# Altium schematic sheet X-Bus.schdoc
size 277 x 134 mm; SheetNumber: 1; SheetTotal: 1
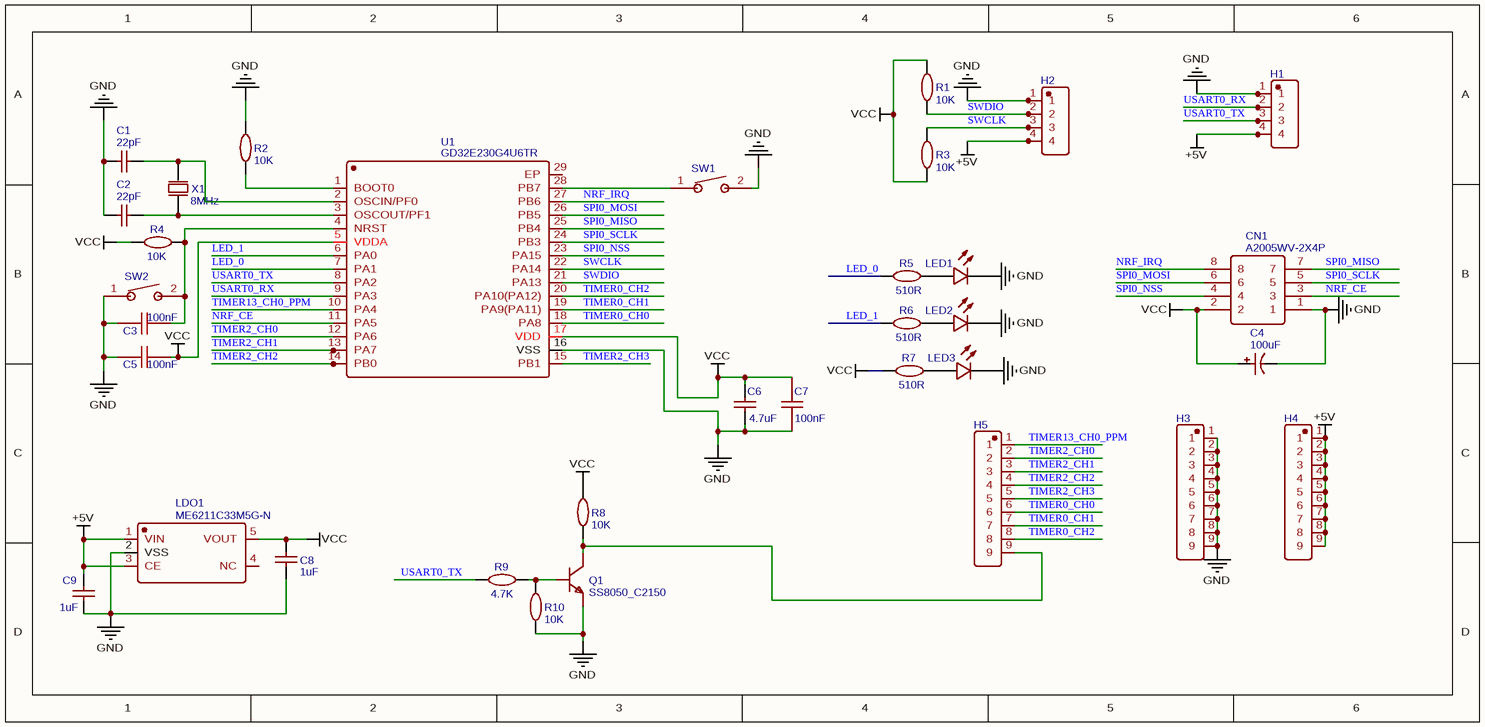
[diagram p0: X-Bus.schdoc]

## Parts
C1  22pF  [C0603_L]
C2  22pF  [C0603_L]
C3  100nF  [C0603_L]
C4  100uF  [CAP 2.5*6.3*11.2-H - BK]
C5  100nF  [C0603_L]
C6  4.7uF  [C0603_L]
C7  100nF  [C0603_L]
C8  1uF  [C0603_L]
C9  1uF  [C0603_L]
CN1  A2005WV-2X4P  [NRF24L01_E01]
H1  GP26-2520WV-4P  [HDR2.54-LI-4P]  (value not drawn)
H2  GP26-2520WV-4P  [HDR2.54-LI-4P]  (value not drawn)
H3  PZ254V-11-09P  [HDR2.54-LI-9P]  (value not drawn)
H4  PZ254V-11-09P  [HDR2.54-LI-9P]  (value not drawn)
H5  PZ254V-11-09P  [HDR2.54-LI-9P]  (value not drawn)
LDO1  ME6211C33M5G-N  [ME6211]
LED1  19-217/GHC-YR1S2/3T  [LED 3MM-B]  (value not drawn)
LED2  19-217/GHC-YR1S2/3T  [LED 3MM-G]  (value not drawn)
LED3  19-217/GHC-YR1S2/3T  [LED 3MM-R]  (value not drawn)
Q1  SS8050_C2150  [SS8050]
R1  10K  [R0603_L]
R2  10K  [R0603_L]
R3  10K  [R0603_L]
R4  10K  [R0603_L]
R5  510R  [R0603_L]
R6  510R  [R0603_L]
R7  510R  [R0603_L]
R8  10K  [R0603_L]
R9  4.7K  [R0603_L]
R10  10K  [R0603_L]
SW1  TSA363G25-250B  [YD-3410]  (value not drawn)
SW2  TSA363G25-250B  [YD-3410]  (value not drawn)
U1  GD32E230G4U6TR  [QFN-28_L4.0-W4.0-P0.40-BL-EP]
X1  8MHz  [OSC 5032-8M]

## Nets
+5V: C9.2 H1.4 H2.4 H4.1 H4.2 H4.3 H4.4 H4.5 H4.6 H4.7 H4.8 H4.9 LDO1.1(VIN) LDO1.3(CE)
GND: C1.1 C2.1 C3.2 C4.2 C5.1 C6.2 C7.2 C8.1 C9.1 CN1.1 H1.1 H2.1 H3.1 H3.2 H3.3 H3.4 H3.5 H3.6 H3.7 H3.8 H3.9 LDO1.2(VSS) LED1.2(C) LED2.2(C) LED3.2(C) Q1.2(E) R2.2 R10.1 SW1.2 SW2.1 U1.16(VSS)
VCC: C4.1 C5.2 C6.1 C7.1 C8.2 CN1.2 LDO1.5(VOUT) R1.2 R3.1 R4.2 R7.2 R8.2 U1.5(VDDA) U1.17(VDD)
LED_0: R5.2 U1.7(PA1)
LED_1: R6.2 U1.6(PA0)
NRF_CE: CN1.3 U1.11(PA5)
NRF_IRQ: CN1.8 U1.27(PB6)
SPI0_MISO: CN1.7 U1.25(PB4)
SPI0_MOSI: CN1.6 U1.26(PB5)
SPI0_NSS: CN1.4 U1.23(PA15)
SPI0_SCLK: CN1.5 U1.24(PB3)
SWCLK: H2.3 R3.2 U1.22(PA14)
SWDIO: H2.2 R1.1 U1.21(PA13)
TIMER0_CH0: H5.6 U1.18(PA8)
TIMER0_CH1: H5.7 U1.19(PA9(PA11))
TIMER0_CH2: H5.8 U1.20(PA10(PA12))
TIMER2_CH0: H5.2 U1.12(PA6)
TIMER2_CH1: H5.3 U1.13(PA7)
TIMER2_CH2: H5.4 U1.14(PB0)
TIMER2_CH3: H5.5 U1.15(PB1)
TIMER13_CH0_PPM: H5.1 U1.10(PA4)
USART0_RX: H1.2 U1.9(PA3)
USART0_TX: H1.3 R9.2 U1.8(PA2)
NetC1_2: C1.2 U1.2(OSCIN/PF0) X1.2(OSC2)
NetC2_2: C2.2 U1.3(OSCOUT/PF1) X1.1(OSC1)
NetC3_1: C3.1 R4.1 SW2.2 U1.4(NRST)
NetH5_9: H5.9 Q1.3(C) R8.1
NetLED1_1: LED1.1(A) R5.1
NetLED2_1: LED2.1(A) R6.1
NetLED3_1: LED3.1(A) R7.1
NetQ1_1: Q1.1(B) R9.1 R10.2
NetR2_1: R2.1 U1.1(BOOT0)
NetSW1_1: SW1.1 U1.28(PB7)

Not connected (* = marked no-connect by the designer): LDO1 4(NC); U1 29(EP)

## Library data of the parts
C1 C2 = 22pF: BOM_Manufacturer: YAGEO; BOM_Manufacturer Part: CC0603JRNPO9BN220; nameAlias: Capacitance; BOM_Supplier: LCSC; BOM_Supplier Part: C105620; BOM_JLCPCB Part Class: Extended Part; spicePre: C; spiceSymbolName: CC0603JRNPO9BN220
C3 C5 C7 = 100nF: BOM_Manufacturer: YAGEO; BOM_Manufacturer Part: CC0603KRX7R9BB104; nameAlias: Capacitance; BOM_Supplier: LCSC; BOM_Supplier Part: C14663; BOM_JLCPCB Part Class: Basic Part; spicePre: C; spiceSymbolName: CC0603KRX7R9BB104
C4 = 100uF: BOM_Manufacturer: Rubycon; BOM_Manufacturer Part: 35YXJ100M6.3X11; nameAlias: Capacitance; BOM_Supplier: LCSC; BOM_Supplier Part: C88754; BOM_JLCPCB Part Class: Extended Part; spicePre: C; spiceSymbolName: 35YXJ100M6.3X11
C6 = 4.7uF: BOM_Manufacturer Part: CL10A475KO8NNNC; BOM_Manufacturer: SAMSUNG; nameAlias: Capacitance; BOM_Supplier: LCSC; BOM_Supplier Part: C19666; BOM_JLCPCB Part Class: Basic Part; spicePre: C; spiceSymbolName: CL10A475KO8NNNC
C8 C9 = 1uF: BOM_Manufacturer Part: CL10A105KB8NNNC; BOM_Manufacturer: SAMSUNG; nameAlias: Capacitance; BOM_Supplier: LCSC; BOM_Supplier Part: C15849; BOM_JLCPCB Part Class: Basic Part; spicePre: C; spiceSymbolName: CL10A105KB8NNNC
CN1 = A2005WV-2X4P: BOM_Manufacturer: Changjiang Connectors; Contributor: LCSC; BOM_Supplier: LCSC; BOM_Supplier Part: C225289; BOM_Manufacturer Part: A2005WV-2x4P; BOM_JLCPCB Part Class: Extended Part; spicePre: C; spiceSymbolName: A2005WV-2X4P
H1 H2 = GP26-2520WV-4P: BOM_Manufacturer: GEPU(歌普); Contributor: LCSC; BOM_Supplier: LCSC; BOM_Supplier Part: C2681739; BOM_Manufacturer Part: GP26-2520WV-4P; BOM_JLCPCB Part Class: Extended Part; spicePre: H; spiceSymbolName: GP26-2520WV-4P
H3-H5 = PZ254V-11-09P: BOM_Manufacturer: XFCN; Contributor: LCSC; BOM_Supplier: LCSC; BOM_Supplier Part: C492408; BOM_Manufacturer Part: PZ254V-11-09P; BOM_JLCPCB Part Class: Extended Part; spicePre: H; spiceSymbolName: PZ254V-11-09P
LDO1 = ME6211C33M5G-N: BOM_Manufacturer: MICRONE; BOM_Supplier: LCSC; BOM_Manufacturer Part: ME6211C33M5G-N; BOM_Supplier Part: C82942; BOM_JLCPCB Part Class: Extended Part; spicePre: L; spiceSymbolName: ME6211C33M5G-N
LED1-LED3 = 19-217/GHC-YR1S2/3T: BOM_Manufacturer: EVERLIGHT; BOM_Supplier: LCSC; BOM_Manufacturer Part: 19-217/GHC-YR1S2/3T; BOM_Supplier Part: C72043; BOM_JLCPCB Part Class: Basic Part; spicePre: L; spiceSymbolName: 19-217/GHC-YR1S2/3T
Q1 = SS8050_C2150: BOM_Manufacturer: CJ; BOM_Supplier: LCSC; BOM_Manufacturer Part: SS8050; BOM_Supplier Part: C2150; BOM_JLCPCB Part Class: Basic Part; spicePre: Q; spiceSymbolName: SS8050_C2150
R1-R4 R8 R10 = 10K: BOM_Manufacturer: YAGEO; BOM_Manufacturer Part: RC0603FR-0710KL; nameAlias: Resistance (Ohms); BOM_Supplier: LCSC; BOM_Supplier Part: C98220; BOM_JLCPCB Part Class: Extended Part; spicePre: R; spiceSymbolName: RC0603FR-0710KL
R5-R7 = 510R: BOM_Manufacturer: YAGEO; BOM_Manufacturer Part: RC0603FR-0710KL; nameAlias: Resistance (Ohms); BOM_Supplier: LCSC; BOM_Supplier Part: C98220; BOM_JLCPCB Part Class: Extended Part; spicePre: R; spiceSymbolName: RC0603FR-0710KL
R9 = 4.7K: BOM_Manufacturer: YAGEO; BOM_Manufacturer Part: RC0603FR-0710KL; nameAlias: Resistance (Ohms); BOM_Supplier: LCSC; BOM_Supplier Part: C98220; BOM_JLCPCB Part Class: Extended Part; spicePre: R; spiceSymbolName: RC0603FR-0710KL
SW1 SW2 = TSA363G25-250B: BOM_Manufacturer: BRIGHT; Contributor: LCSC; BOM_Supplier: LCSC; BOM_Supplier Part: C354943; BOM_Manufacturer Part: TSA363G25-250B; BOM_JLCPCB Part Class: Extended Part; spicePre: S; spiceSymbolName: TSA363G25-250B
U1 = GD32E230G4U6TR: BOM_Manufacturer: GigaDevice Semicon Beijing; Contributor: LCSC; BOM_Supplier: LCSC; BOM_Supplier Part: C380784; BOM_Manufacturer Part: GD32E230G4U6TR; BOM_JLCPCB Part Class: Extended Part; spicePre: U; spiceSymbolName: GD32E230G4U6TR
X1 = 8MHz: BOM_Manufacturer: Zhejiang Abel Elec; nameAlias: Frequency; Contributor: LCSC; BOM_Supplier: LCSC; BOM_Supplier Part: C122522; BOM_Manufacturer Part: -; BOM_JLCPCB Part Class: Extended Part; spicePre: X; spiceSymbolName: SMD-5032_2P 8M 20pf 30ppm